# Altium schematic sheet Telemetry_Board.SchDoc: UCR-02 Telemetry Module
size 431 x 279 mm; Author: Issam Akhtar; CompanyName: UCalgary Racing; Engineer: Issam Akhtar; SheetNumber: 1; SheetTotal: 4
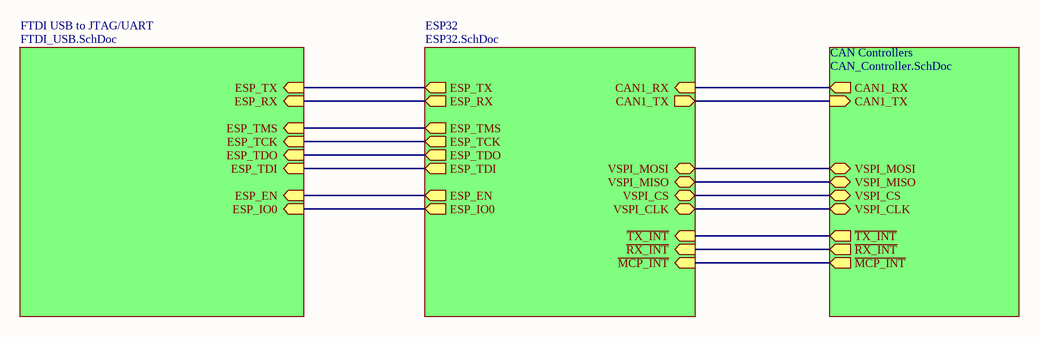
[diagram p0: Telemetry_Board.SchDoc]

## Sub-sheets
CAN Controllers = CAN_Controller.SchDoc: CAN1_RX (out), CAN1_TX (in), VSPI_CS (bidir), VSPI_CLK (bidir), VSPI_MISO (bidir), VSPI_MOSI (bidir), ~{TX_INT} (out), ~{RX_INT} (out), ~{MCP_INT} (out)
ESP32 = ESP32.SchDoc: ESP_TX (out), ESP_RX (out), ESP_TMS (out), ESP_TCK (out), ESP_TDO (out), ESP_TDI (out), CAN1_RX (in), CAN1_TX (out), VSPI_CS (bidir), VSPI_CLK (bidir), VSPI_MISO (bidir), VSPI_MOSI (bidir), ESP_EN (out), ESP_IO0 (out), ~{TX_INT} (in), ~{RX_INT} (in), ~{MCP_INT} (in)
FTDI USB to JTAG/UART = FTDI_USB.SchDoc: ESP_TX (in), ESP_RX (in), ESP_TMS (in), ESP_TCK (in), ESP_TDO (in), ESP_TDI (in), ESP_EN (in), ESP_IO0 (in)

## Nets
(unnamed): sheet ESP32/ESP_TX, sheet FTDI USB to JTAG/UART/ESP_TX
(unnamed): sheet ESP32/ESP_RX, sheet FTDI USB to JTAG/UART/ESP_RX
(unnamed): sheet ESP32/ESP_TMS, sheet FTDI USB to JTAG/UART/ESP_TMS
(unnamed): sheet ESP32/ESP_TCK, sheet FTDI USB to JTAG/UART/ESP_TCK
(unnamed): sheet ESP32/ESP_TDO, sheet FTDI USB to JTAG/UART/ESP_TDO
(unnamed): sheet ESP32/ESP_TDI, sheet FTDI USB to JTAG/UART/ESP_TDI
(unnamed): sheet ESP32/CAN1_RX, sheet CAN Controllers/CAN1_RX
(unnamed): sheet ESP32/CAN1_TX, sheet CAN Controllers/CAN1_TX
(unnamed): sheet ESP32/VSPI_CS, sheet CAN Controllers/VSPI_CS
(unnamed): sheet ESP32/VSPI_CLK, sheet CAN Controllers/VSPI_CLK
(unnamed): sheet ESP32/VSPI_MISO, sheet CAN Controllers/VSPI_MISO
(unnamed): sheet ESP32/VSPI_MOSI, sheet CAN Controllers/VSPI_MOSI
(unnamed): sheet ESP32/ESP_EN, sheet FTDI USB to JTAG/UART/ESP_EN
(unnamed): sheet ESP32/ESP_IO0, sheet FTDI USB to JTAG/UART/ESP_IO0
(unnamed): sheet ESP32/~{TX_INT}, sheet CAN Controllers/~{TX_INT}
(unnamed): sheet ESP32/~{RX_INT}, sheet CAN Controllers/~{RX_INT}
(unnamed): sheet ESP32/~{MCP_INT}, sheet CAN Controllers/~{MCP_INT}

## Notes on the sheet
- Title
- Date
- Sheet
- of
- File
- Author